# Altium schematic sheet Dev.SchDoc
size 292 x 193 mm; Author: Power Lin; DocumentNumber: 4; SheetNumber: 4; SheetTotal: 3; Website: wiki-power.com
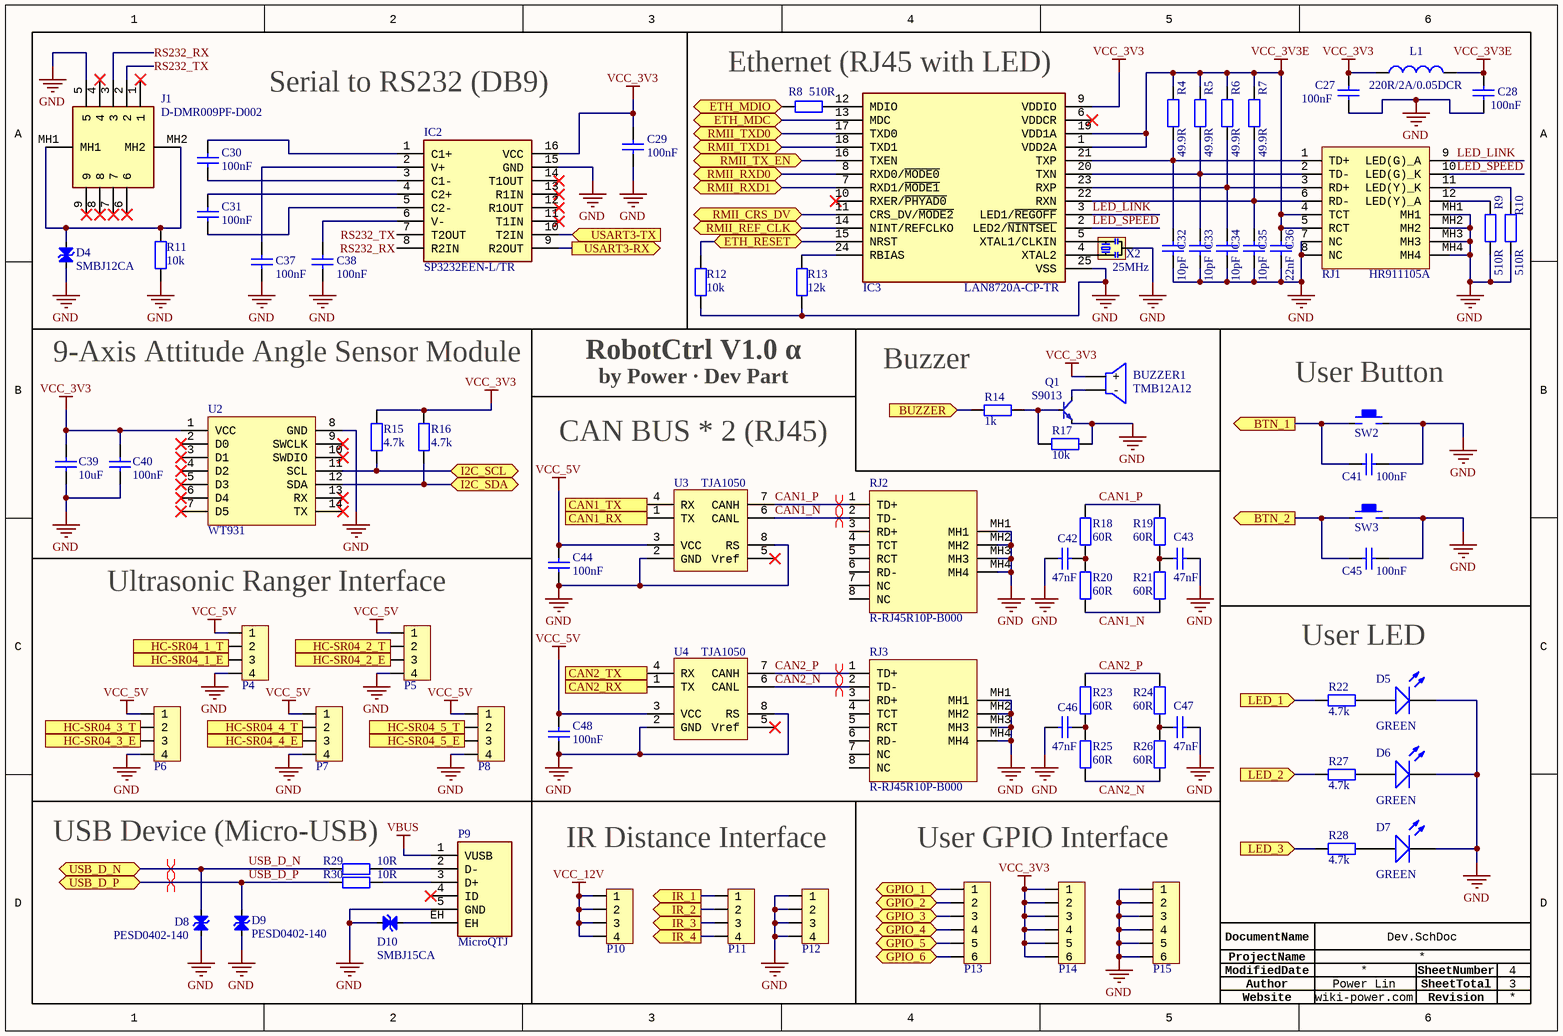
[diagram p0: Dev.SchDoc]

## Parts
BUZZER1  TMB12A12  [DIP,P=7.6mm]
C27  100nF  [CAP-0603]
C28  100nF  [CAP-0603]
C29  100nF  [CAP-0603]
C30  100nF  [CAP-0603]
C31  100nF  [CAP-0603]
C32  10pF  [CAP-0603]
C33  10pF  [CAP-0603]
C34  10pF  [CAP-0603]
C35  10pF  [CAP-0603]
C36  22nF  [CAP-0603]
C37  100nF  [CAP-0603]
C38  100nF  [CAP-0603]
C39  10uF  [CAP-0603]
C40  100nF  [CAP-0603]
C41  100nF  [CAP-0603]
C42  47nF  [CAP-0603]
C43  47nF  [CAP-0603]
C44  100nF  [CAP-0603]
C45  100nF  [CAP-0603]
C46  47nF  [CAP-0603]
C47  47nF  [CAP-0603]
C48  100nF  [CAP-0603]
D4  SMBJ12CA  [DO-214AA/SMB]
D5  GREEN  [LED-0603]
D6  GREEN  [LED-0603]
D7  GREEN  [LED-0603]
D8  PESD0402-140  [D-0402]
D9  PESD0402-140  [D-0402]
D10  SMBJ15CA  [DO-214AA/SMB]
IC2  SP3232EEN-L/TR  [SOIC-16_150mil]
IC3  LAN8720A-CP-TR  [QFN-24-4x4]
J1  D-DMR009PF-D002  [Through Hole,P=2.77mm]
L1  220R/2A/0.05DCR  [L-0603]
P4  HDR1x4_2.54  [HDR1x4_2.54_180]  (value not drawn)
P5  HDR1x4_2.54  [HDR1x4_2.54_180]  (value not drawn)
P6  HDR1x4_2.54  [HDR1x4_2.54_180]  (value not drawn)
P7  HDR1x4_2.54  [HDR1x4_2.54_180]  (value not drawn)
P8  HDR1x4_2.54  [HDR1x4_2.54_180]  (value not drawn)
P9  MicroQTJ  [USB-MICRO]
P10  HDR1x4_2.54  [HDR1x4_2.54_180]  (value not drawn)
P11  HDR1x4_2.54  [HDR1x4_2.54_180]  (value not drawn)
P12  HDR1x4_2.54  [HDR1x4_2.54_180]  (value not drawn)
P13  HDR1x6  [HDR1X6_2.54_180]  (value not drawn)
P14  HDR1x6  [HDR1X6_2.54_180]  (value not drawn)
P15  HDR1x6  [HDR1X6_2.54_180]  (value not drawn)
Q1  S9013  [SOT-23-3]
R4  49.9R  [R-0603]
R5  49.9R  [R-0603]
R6  49.9R  [R-0603]
R7  49.9R  [R-0603]
R8  510R  [R-0603]
R9  510R  [R-0603]
R10  510R  [R-0603]
R11  10k  [R-0603]
R12  10k  [R-0603]
R13  12k  [R-0603]
R14  1k  [R-0603]
R15  4.7k  [R-0603]
R16  4.7k  [R-0603]
R17  10k  [R-0603]
R18  60R  [R-0603]
R19  60R  [R-0603]
R20  60R  [R-0603]
R21  60R  [R-0603]
R22  4.7k  [R-0603]
R23  60R  [R-0603]
R24  60R  [R-0603]
R25  60R  [R-0603]
R26  60R  [R-0603]
R27  4.7k  [R-0603]
R28  4.7k  [R-0603]
R29  10R  [R-0603]
R30  10R  [R-0603]
RJ1  HR911105A  [HR911105A]
RJ2  R-RJ45R10P-B000  [RRJ45R10PB000]
RJ3  R-RJ45R10P-B000  [RRJ45R10PB000]
SW2  KEY  [KEY-4P-4.2*3.4*2.5]  (value not drawn)
SW3  KEY  [KEY-4P-4.2*3.4*2.5]  (value not drawn)
U2  WT931  [WT931]
U3  TJA1050  [SOIC_8]
U4  TJA1050  [SOIC_8]
X2  25MHz  [SMD3213-3P]

## Ports
BTN_1 (out), BTN_2 (out), BUZZER (in), CAN1_RX (out), CAN1_TX (in), CAN2_RX (out), CAN2_TX (in), ETH_MDC (bidir), ETH_MDIO (bidir), ETH_RESET (bidir), GPIO_1 (bidir), GPIO_2 (bidir), GPIO_3 (bidir), GPIO_4 (bidir), GPIO_5 (bidir), GPIO_6 (bidir), HC-SR04_1_E (out), HC-SR04_1_T (in), HC-SR04_2_E (out), HC-SR04_2_T (in), HC-SR04_3_E (out), HC-SR04_3_T (in), HC-SR04_4_E (out), HC-SR04_4_T (in), HC-SR04_5_E (out), HC-SR04_5_T (in), I2C_SCL (bidir), I2C_SDA (bidir), IR_1 (out), IR_2 (out), IR_3 (out), IR_4 (out), LED_1 (in), LED_2 (in), LED_3 (in), RMII_CRS_DV (bidir), RMII_REF_CLK (bidir), RMII_RXD0 (bidir), RMII_RXD1 (bidir), RMII_TX_EN (bidir), RMII_TXD0 (bidir), RMII_TXD1 (bidir), USART3-RX (out), USART3-TX (in), USB_D_N (bidir), USB_D_P (bidir)

## Nets
GND: C27.1 C28.1 C29.1 C32.1 C33.1 C34.1 C35.1 C36.1 C37.1 C38.1 C39.2 C40.2 C41.1 C42.2 C43.2 C44.1 C45.1 C46.2 C47.2 C48.1 D4.1 D5.K D6.K D7.K D8.1 D9.1 D10.2 IC2.15(GND) IC3.25(VSS) J1.5 P4.4 P5.4 P6.4 P7.4 P8.4 P9.5(GND) P12.1 P12.2 P12.3 P12.4 P15.1 P15.2 P15.3 P15.4 P15.5 P15.6 Q1.2(E) R9.1 R10.1 R11.1 R12.2 R13.2 R17.1 RJ1.7(NC) RJ1.8(NC) RJ1.MH1 RJ1.MH2 RJ1.MH3 RJ1.MH4 RJ2.MH1 RJ2.MH2 RJ2.MH3 RJ2.MH4 RJ3.MH1 RJ3.MH2 RJ3.MH3 RJ3.MH4 SW2.2 SW3.2 U2.8(GND) U3.2(GND) U3.8(RS) U4.2(GND) U4.8(RS) X2.2(GND)
VBUS: P9.1(VUSB)
VCC_3V3: BUZZER1.1(+) C27.2 C29.2 C39.1 C40.1 IC2.16(VCC) IC3.9(VDDIO) L1.1 P14.1 P14.2 P14.3 P14.4 P14.5 P14.6 R15.2 R16.2 U2.1(VCC)
VCC_3V3E: C28.2 C36.2 IC3.1(VDD2A) IC3.19(VDD1A) L1.2 R4.2 R5.2 R6.2 R7.2 RJ1.4(TCT) RJ1.5(RCT)
VCC_5V: C44.2 C48.2 P4.1 P5.1 P6.1 P7.1 P8.1 U3.3(VCC) U4.3(VCC)
VCC_12V: P10.1 P10.2 P10.3 P10.4
BTN_1: C41.2 SW2.1 ; port BTN_1
BTN_2: C45.2 SW3.1 ; port BTN_2
BUZZER: R14.1 ; port BUZZER
CAN1_N: R20.2 R21.1 RJ2.2(TD-) U3.6(CANL)
CAN1_P: R18.1 R19.2 RJ2.1(TD+) U3.7(CANH)
CAN1_RX: U3.1(TX) ; port CAN1_RX
CAN1_TX: U3.4(RX) ; port CAN1_TX
CAN2_N: R25.2 R26.1 RJ3.2(TD-) U4.6(CANL)
CAN2_P: R23.1 R24.2 RJ3.1(TD+) U4.7(CANH)
CAN2_RX: U4.1(TX) ; port CAN2_RX
CAN2_TX: U4.4(RX) ; port CAN2_TX
ETH_MDC: IC3.13(MDC) ; port ETH_MDC
ETH_MDIO: R8.2 ; port ETH_MDIO
ETH_RESET: IC3.15(NRST) R12.1 ; port ETH_RESET
GPIO_1: P13.1 ; port GPIO_1
GPIO_2: P13.2 ; port GPIO_2
GPIO_3: P13.3 ; port GPIO_3
GPIO_4: P13.4 ; port GPIO_4
GPIO_5: P13.5 ; port GPIO_5
GPIO_6: P13.6 ; port GPIO_6
HC-SR04_1_E: P4.3 ; port HC-SR04_1_E
HC-SR04_1_T: P4.2 ; port HC-SR04_1_T
HC-SR04_2_E: P5.3 ; port HC-SR04_2_E
HC-SR04_2_T: P5.2 ; port HC-SR04_2_T
HC-SR04_3_E: P6.3 ; port HC-SR04_3_E
HC-SR04_3_T: P6.2 ; port HC-SR04_3_T
HC-SR04_4_E: P7.3 ; port HC-SR04_4_E
HC-SR04_4_T: P7.2 ; port HC-SR04_4_T
HC-SR04_5_E: P8.3 ; port HC-SR04_5_E
HC-SR04_5_T: P8.2 ; port HC-SR04_5_T
I2C_SCL: R15.1 U2.11(SCL) ; port I2C_SCL
I2C_SDA: R16.1 U2.12(SDA) ; port I2C_SDA
IR_1: P11.1 ; port IR_1
IR_2: P11.2 ; port IR_2
IR_3: P11.3 ; port IR_3
IR_4: P11.4 ; port IR_4
LED_1: R22.2 ; port LED_1
LED_2: R27.2 ; port LED_2
LED_3: R28.2 ; port LED_3
LED_LINK: IC3.3(LED1/~{REGOFF}) RJ1.9(LED(G)_A)
LED_SPEED: IC3.2(LED2/~{NINTSEL}) RJ1.10(LED(G)_K)
RMII_CRS_DV: IC3.11(CRS_DV/~{MODE2}) ; port RMII_CRS_DV
RMII_REF_CLK: IC3.14(NINT/REFCLKO) ; port RMII_REF_CLK
RMII_RXD0: IC3.8(RXD0/~{MODE0}) ; port RMII_RXD0
RMII_RXD1: IC3.7(RXD1/~{MODE1}) ; port RMII_RXD1
RMII_TX_EN: IC3.16(TXEN) ; port RMII_TX_EN
RMII_TXD0: IC3.17(TXD0) ; port RMII_TXD0
RMII_TXD1: IC3.18(TXD1) ; port RMII_TXD1
RS232_RX: IC2.8(R2IN) J1.3
RS232_TX: IC2.7(T2OUT) J1.2
USART3-RX: IC2.9(R2OUT) ; port USART3-RX
USART3-TX: IC2.10(T2IN) ; port USART3-TX
USB_D_N: D8.2 R29.1 ; port USB_D_N
USB_D_P: D9.2 R30.1 ; port USB_D_P
NetBUZZER1_2: BUZZER1.2(-) Q1.3(C)
NetC30_1: C30.1 IC2.3(C1-)
NetC30_2: C30.2 IC2.1(C1+)
NetC31_1: C31.1 IC2.5(C2-)
NetC31_2: C31.2 IC2.4(C2+)
NetC32_2: C32.2 IC3.21(TXP) R4.1 RJ1.1(TD+)
NetC33_2: C33.2 IC3.20(TXN) R5.1 RJ1.2(TD-)
NetC34_2: C34.2 IC3.23(RXP) R6.1 RJ1.3(RD+)
NetC35_2: C35.2 IC3.22(RXN) R7.1 RJ1.6(RD-)
NetC37_2: C37.2 IC2.2(V+)
NetC38_2: C38.2 IC2.6(V-)
NetC42_1: C42.1 R18.2 R20.1
NetC43_1: C43.1 R19.1 R21.2
NetC46_1: C46.1 R23.2 R25.1
NetC47_1: C47.1 R24.1 R26.2
NetD4_2: D4.2 J1.MH1 J1.MH2 R11.2
NetD5_A: D5.A R22.1
NetD6_A: D6.A R27.1
NetD7_A: D7.A R28.1
NetD10_1: D10.1 P9.EH
NetIC3_4: IC3.4(XTAL2) X2.1(OSC1)
NetIC3_5: IC3.5(XTAL1/CLKIN) X2.3(OSC2)
NetIC3_12: IC3.12(MDIO) R8.1
NetIC3_24: IC3.24(RBIAS) R13.1
NetP9_2: P9.2(D-) R29.2
NetP9_3: P9.3(D+) R30.2
NetQ1_1: Q1.1(B) R14.2 R17.2
NetR9_2: R9.2 RJ1.12(LED(Y)_A)
NetR10_2: R10.2 RJ1.11(LED(Y)_K)

Not connected (* = marked no-connect by the designer): IC2 11(T1IN)* 12(R1OUT)* 13(R1IN)* 14(T1OUT)*; IC3 6(VDDCR)* 10(RXER/~{PHYAD0})*; J1 1* 4* 6* 7* 8* 9*; P9 4(ID)*; RJ2 3(RD+) 4(TCT) 5(RCT) 6(RD-) 7(NC) 8(NC); RJ3 3(RD+) 4(TCT) 5(RCT) 6(RD-) 7(NC) 8(NC); U2 2(D0)* 3(D1)* 4(D2)* 5(D3)* 6(D4)* 7(D5)* 9(SWCLK)* 10(SWDIO)* 13(RX)* 14(TX)*; U3 5(Vref)*; U4 5(Vref)*

## Layout directives
differential pair: CAN1_N, CAN1_P, CAN2_N, CAN2_P, USB_D_N, USB_D_P

## Notes on the sheet
- Serial to RS232 (DB9)
- Ethernet (RJ45 with LED)
- 9-Axis Attitude Angle Sensor Module
- RobotCtrl V1.0 α
- by Power · Dev Part
- (near R14) Buzzer
- (near SW2) User Button
- CAN BUS * 2 (RJ45)
- Ultrasonic Ranger Interface
- User LED
- USB Device (Micro-USB)
- IR Distance Interface
- User GPIO Interface
- Author
- DocumentName
- ModifiedDate
- ProjectName
- SheetNumber
- SheetTotal
- Website
- Revision

## Library data of the parts
BUZZER1 = BUZZER: TMB12A12 有源蜂鸣器
C27-C48 = CAP: 贴片电容; ComponentLink1Description: 供应商链接; ComponentLink1URL: http://www.szlcsc.com/product/details_53938.html; Package: 0402; Supplier: LC; SuppliersPartNumber: C52923
D4 D8-D10 = TVS_C
D5-D7 = LED: 发光二极管; pin to pad: A>1 K>2; ComponentLink1Description: 供应商链接; ComponentLink1URL: http://www.szlcsc.com/product/details_2663.html; Package: 0603; Supplier: LC; SuppliersPartNumber: C2290
IC2 = SP3232EEN: RS232 芯片; Manufacturer_Name: MaxLinear; Datasheet Link: https://www.maxlinear.com/ds/sp3222e_sp3232e.pdf; Height: 1.75mm; Manufacturer_Part_Number: SP3232EEN-L/TR; Mouser Part Number: 701-SP3232EEN-L/TR; Mouser Price/Stock: https://www.mouser.co.uk/ProductDetail/MaxLinear/SP3232EEN-L-TR?qs=Hy8V1%2FADhVKNh9v9NvoeCw%3D%3D; Arrow Part Number: SP3232EEN-L/TR; Arrow Price/Stock: https://www.arrow.com/en/products/sp3232een-ltr/maxlinear-inc
IC3 = LAN8720A-CP-TR: Integrated Circuit; Manufacturer_Name: Microchip; Datasheet Link: https://componentsearchengine.com/Datasheets/1/LAN8720A-CP-TR.pdf; Height: 1mm; Manufacturer_Part_Number: LAN8720A-CP-TR; Mouser Part Number: 886-LAN8720A-CP-TR; Mouser Price/Stock: https://www.mouser.co.uk/ProductDetail/Microchip-Technology/LAN8720A-CP-TR?qs=pA5MXup5wxG3QiSvrqf%2FHQ%3D%3D; Arrow Part Number: LAN8720A-CP-TR; Arrow Price/Stock: https://www.arrow.com/en/products/lan8720a-cp-tr/microchip-technology?region=nac
J1 = DB9: D-Sub 连接器; Manufacturer_Name: TE Connectivity; Manufacturer_Part_Number: 5747844-5; Datasheet Link: http://www.te.com/commerce/DocumentDelivery/DDEController?Action=srchrtrv&DocNm=82068_AMPLIMITE_Right-Angle_Posted_Conn&DocType=Catalog+Section&DocLang=English&PartCntxt=; Height: 12.9286mm; Mouser Part Number: 571-5747844-5; Mouser Price/Stock: https://www.mouser.co.uk/ProductDetail/TE-Connectivity/5747844-5?qs=x6EjVpvqMVPrkQsJHUlJGw%3D%3D; Arrow Part Number: 5747844-5; Arrow Price/Stock: https://www.arrow.com/en/products/5747844-5/te-connectivity
L1 = BEAD: BLM18KG221SN1D; ComponentLink1Description: 供应商链接; ComponentLink1URL: http://www.szlcsc.com/product/details_33003.html; Package: 0402; Supplier: LC; SuppliersPartNumber: C32041
P4-P8 P10-P12 = HDR1x4_2.54: Header
P9 = USB_MICRO
P13-P15 = HDR1x6_2.54: Header
Q1 = BJT_NPN
R4-R30 = RES: 贴片电阻; Package: 0805; Supplier: LC; SuppliersPartNumber: C17798
RJ1 = RJ45_LED
RJ2 RJ3 = RJ45
SW2 SW3 = KEY: 按键开关
U2 = WT931: 陀螺仪模组
U3 U4 = TJA1050: CAN 控制器（5V）
X2 = XTAL: CSTCE25M00G51-R0